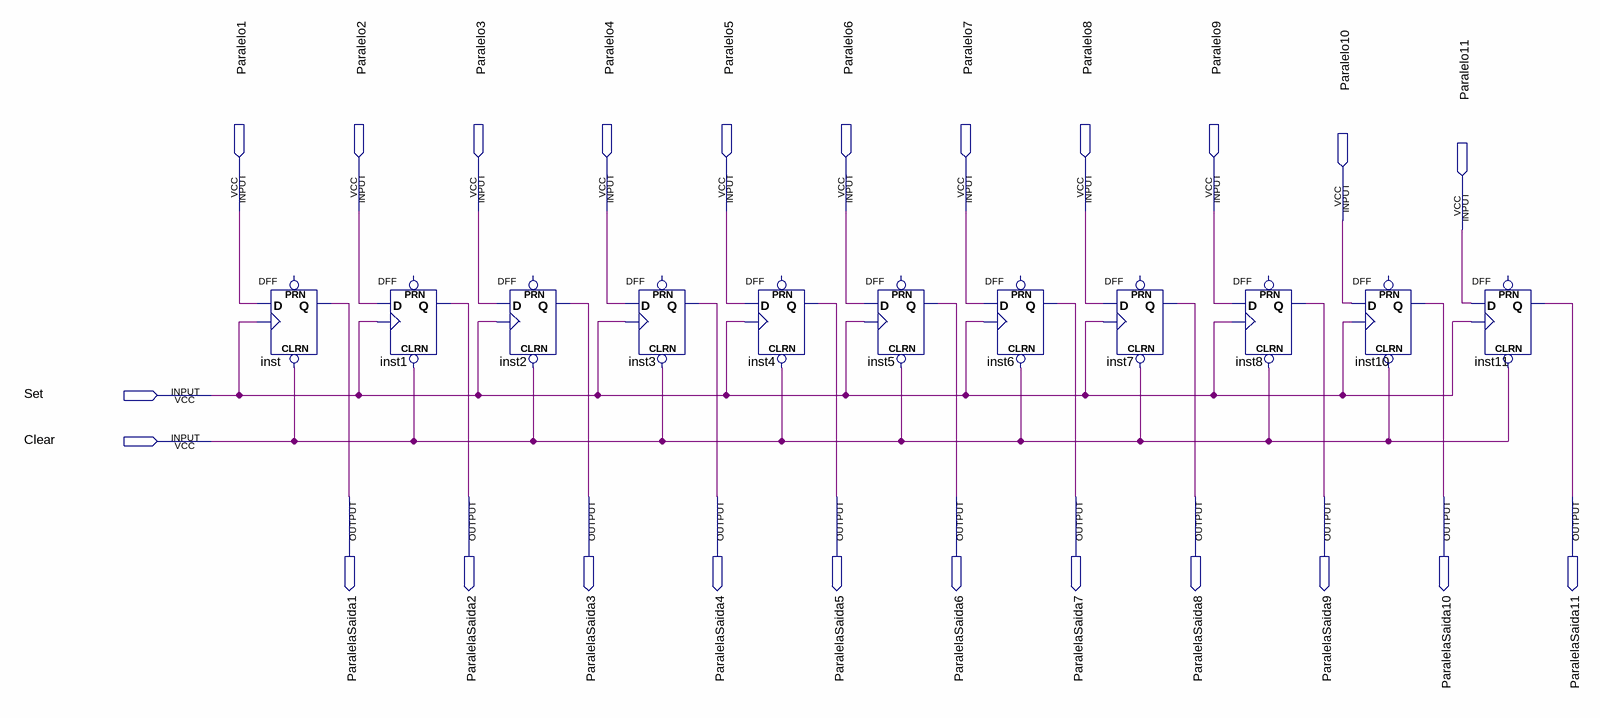
[diagram p0: schematic sheet]
// Quartus schematic ParaleloParalelo.bdf as structural Verilog: 11 symbols, 24 pins
module ParaleloParalelo (
  input  Paralelo1,
  input  Paralelo2,
  input  Paralelo3,
  input  Paralelo4,
  input  Paralelo5,
  input  Paralelo6,
  input  Paralelo7,
  input  Paralelo8,
  input  Paralelo9,
  input  Paralelo10,
  input  Paralelo11,
  input  Set,
  input  Clear,
  output ParalelaSaida1,
  output ParalelaSaida2,
  output ParalelaSaida3,
  output ParalelaSaida4,
  output ParalelaSaida5,
  output ParalelaSaida6,
  output ParalelaSaida7,
  output ParalelaSaida8,
  output ParalelaSaida9,
  output ParalelaSaida10,
  output ParalelaSaida11
);

  DFF inst (.CLRN(Clear), .CLK(Set), .D(Paralelo1), .Q(ParalelaSaida1));  // open: PRN
  DFF inst1 (.CLRN(Clear), .CLK(Set), .D(Paralelo2), .Q(ParalelaSaida2));  // open: PRN
  DFF inst2 (.CLRN(Clear), .CLK(Set), .D(Paralelo3), .Q(ParalelaSaida3));  // open: PRN
  DFF inst3 (.CLRN(Clear), .CLK(Set), .D(Paralelo4), .Q(ParalelaSaida4));  // open: PRN
  DFF inst4 (.CLRN(Clear), .CLK(Set), .D(Paralelo5), .Q(ParalelaSaida5));  // open: PRN
  DFF inst5 (.CLRN(Clear), .CLK(Set), .D(Paralelo6), .Q(ParalelaSaida6));  // open: PRN
  DFF inst6 (.CLRN(Clear), .CLK(Set), .D(Paralelo7), .Q(ParalelaSaida7));  // open: PRN
  DFF inst7 (.CLRN(Clear), .CLK(Set), .D(Paralelo8), .Q(ParalelaSaida8));  // open: PRN
  DFF inst8 (.CLRN(Clear), .CLK(Set), .D(Paralelo9), .Q(ParalelaSaida9));  // open: PRN
  DFF inst10 (.CLRN(Clear), .CLK(Set), .D(Paralelo10), .Q(ParalelaSaida10));  // open: PRN
  DFF inst11 (.CLRN(Clear), .CLK(Set), .D(Paralelo11), .Q(ParalelaSaida11));  // open: PRN
endmodule
